# Altium schematic sheet Hung_Doan.schdoc
size A
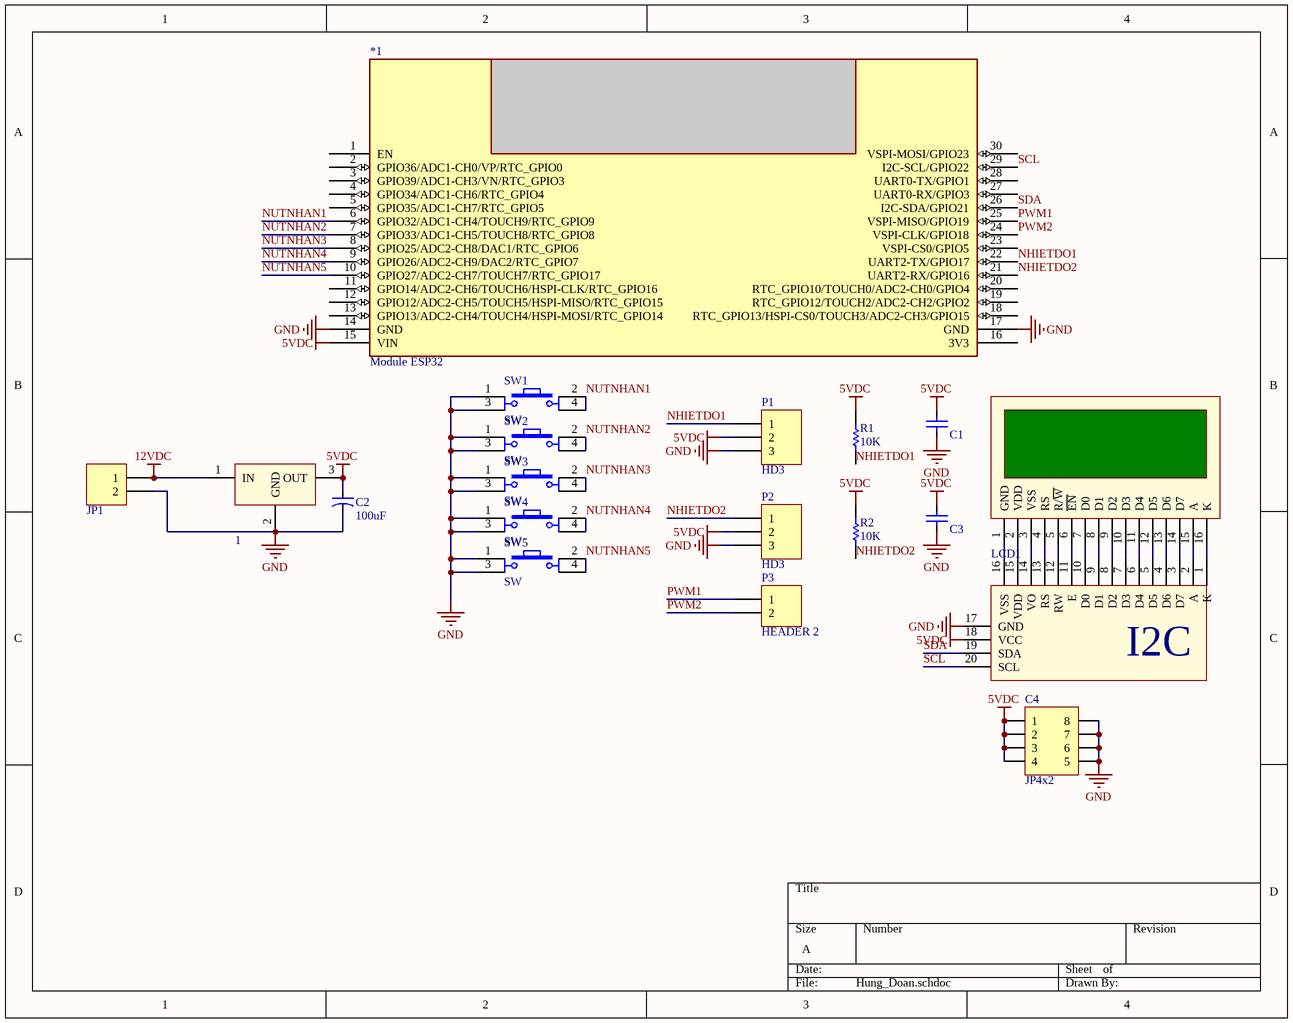
[diagram p0: Hung_Doan.schdoc]

## Parts
1  78Mxx  [TO252]  (value not drawn)
*1  Module ESP32  [Module ESP32]
*2  Module I2C  [Module I2C]  (value not drawn)
C1  104  [CAP-0805-SC]  (value not drawn)
C2  100uF  [CA-ALU-2.54]
C3  104  [CAP-0805-SC]  (value not drawn)
C4  JP4x2  [JP4-D2C]
JP1  Header 2_1  [HED2]  (value not drawn)
LCD1  LCD 20x4  [LCD 20x4]  (value not drawn)
P1  HD3  [XH 2.54-3P-CURVED]
P2  HD3  [XH 2.54-3P-CURVED]
P3  HEADER 2  [XH 2.54-2P-CURVED]
R1  10K  [RES-0805-SC]
R2  10K  [RES-0805-SC]
SW1  SW  [SW4B]
SW2  SW  [SW4B]
SW3  SW  [SW4B]
SW4  SW  [SW4B]
SW5  SW  [SW4B]

## Nets
5VDC: 1.3(OUT) *1.15(VIN) *2.18(VCC) C1.1 C2.1 C3.1 C4.1 C4.2 C4.3 C4.4 P1.2 P2.2 R1.2 R2.2
12VDC: 1.1(IN) JP1.1
GND: 1.2(GND) *1.14(GND) *1.17(GND) *2.17(GND) C1.2 C2.2 C3.2 C4.5 C4.6 C4.7 C4.8 JP1.2 P1.3 P2.3 SW1.1 SW1.3 SW2.1 SW2.3 SW3.1 SW3.3 SW4.1 SW4.3 SW5.1 SW5.3
NHIETDO1: *1.22(UART2-TX/GPIO17) P1.1 R1.1
NHIETDO2: *1.21(UART2-RX/GPIO16) P2.1 R2.1
NUTNHAN1: *1.6(GPIO32/ADC1-CH4/TOUCH9/RTC_GPIO9) SW1.2 SW1.4
NUTNHAN2: *1.7(GPIO33/ADC1-CH5/TOUCH8/RTC_GPIO8) SW2.2 SW2.4
NUTNHAN3: *1.8(GPIO25/ADC2-CH8/DAC1/RTC_GPIO6) SW3.2 SW3.4
NUTNHAN4: *1.9(GPIO26/ADC2-CH9/DAC2/RTC_GPIO7) SW4.2 SW4.4
NUTNHAN5: *1.10(GPIO27/ADC2-CH7/TOUCH7/RTC_GPIO17) SW5.2 SW5.4
PWM1: *1.25(VSPI-MISO/GPIO19) P3.1
PWM2: *1.24(VSPI-CLK/GPIO18) P3.2
SCL: *1.29(I2C-SCL/GPIO22) *2.20(SCL)
SDA: *1.26(I2C-SDA/GPIO21) *2.19(SDA)
Net*2_1: *2.1(K) LCD1.16(K)
Net*2_2: *2.2(A) LCD1.15(A)
Net*2_3: *2.3(D7) LCD1.14(D7)
Net*2_4: *2.4(D6) LCD1.13(D6)
Net*2_5: *2.5(D5) LCD1.12(D5)
Net*2_6: *2.6(D4) LCD1.11(D4)
Net*2_7: *2.7(D3) LCD1.10(D3)
Net*2_8: *2.8(D2) LCD1.9(D2)
Net*2_9: *2.9(D1) LCD1.8(D1)
Net*2_10: *2.10(D0) LCD1.7(D0)
Net*2_11: *2.11(E) LCD1.6(~{EN})
Net*2_12: *2.12(RW) LCD1.5(R/~{W})
Net*2_13: *2.13(RS) LCD1.4(RS)
Net*2_14: *2.14(VO) LCD1.3(VSS)
Net*2_15: *2.15(VDD) LCD1.2(VDD)
Net*2_16: *2.16(VSS) LCD1.1(GND)

Not connected (* = marked no-connect by the designer): *1 1(EN) 2(GPIO36/ADC1-CH0/VP/RTC_GPIO0) 3(GPIO39/ADC1-CH3/VN/RTC_GPIO3) 4(GPIO34/ADC1-CH6/RTC_GPIO4) 5(GPIO35/ADC1-CH7/RTC_GPIO5) 11(GPIO14/ADC2-CH6/TOUCH6/HSPI-CLK/RTC_GPIO16) 12(GPIO12/ADC2-CH5/TOUCH5/HSPI-MISO/RTC_GPIO15) 13(GPIO13/ADC2-CH4/TOUCH4/HSPI-MOSI/RTC_GPIO14) 16(3V3) 18(RTC_GPIO13/HSPI-CS0/TOUCH3/ADC2-CH3/GPIO15) 19(RTC_GPIO12/TOUCH2/ADC2-CH2/GPIO2) 20(RTC_GPIO10/TOUCH0/ADC2-CH0/GPIO4) 23(VSPI-CS0/GPIO5) 27(UART0-RX/GPIO3) 28(UART0-TX/GPIO1) 30(VSPI-MOSI/GPIO23)

## Notes on the sheet
- (in symbol Module I2C) I2C

## Library data of the parts
C1 C3 = CAP-SMDCHIP
C2 = CN-ALU-DIP: Capacitor (Semiconductor SIM Model); Value: 104; LatestRevisionDate: 17-Jul-2002; LatestRevisionNote: Re-released for DXP Platform.; PackageReference: C1206; Publisher: Altium Limited
C4 = JP4x2: WR-PHD 2.54 mm Dual Socket Header; Manufacturer: W¨¹rth Elektronik eiSos GmbH; partNo: 61300821821; ComponentLink1 Description: Manufacturer; ComponentLink2 Description: Datasheet; NoPins: 08; Created Date: 29 March 2013; ComponentLink1URL: http://www.we-online.com; ComponentLink2URL: http://katalog.we-online.de/em/datasheet/6130xx21821.pdf; Created by: Karrer Zheng
JP1 = Header 2_1: Header, 2-Pin; Manufacturer: Generic Components; Class: Connector; Value: Header 2
P1 P2 = HEADER 3
R1 R2 = RES
SW1-SW5 = SW4: Switch button 4 pin; Value: Button chip 4 pin